# Altium project BopIt.PrjPcb
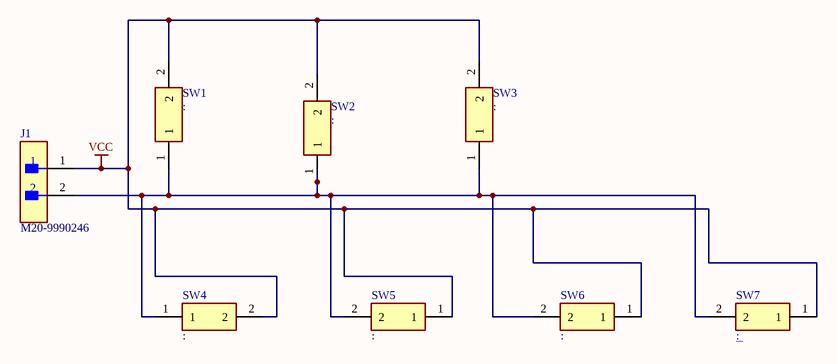
[diagram p0: CodeSchematic.SchDoc]
2 sheets, 43 parts. Net scope: global (net labels, ports and power ports of the same name join across sheets).
Board files: codePCB.PcbDoc, BopIt.PcbDoc
Sheets:
  CodeSchematic.SchDoc
  BopIt.SchDoc

## Sheet CodeSchematic.SchDoc
size A; SheetNumber: 2; SheetTotal: 2

### Parts
(Parts that share a designator on the sheet are numbered #1, #2 ... from top to bottom, then left to right.)
J1#1  M20-9990246  [FP-M20-9990246-MFG]
SW1#1  (no value)  [SW_PG151101S11]
SW2  (no value)  [SW_PG151101S11]
SW3  (no value)  [SW_PG151101S11]
SW4  (no value)  [SW_PG151101S11]
SW5  (no value)  [SW_PG151101S11]
SW6  (no value)  [SW_PG151101S11]
SW7  (no value)  [SW_PG151101S11]

### Nets
VCC: J1#1.1 SW1#1.2 SW2.2 SW3.2 SW4.2 SW5.1 SW6.1 SW7.1
NetJ1#1_2: J1#1.2 SW1#1.1 SW2.1 SW3.1 SW4.1 SW5.2 SW6.2 SW7.2

### Library data of the parts
J1#1 = CMP-15831-000009-1: CONN HEADER VERT 2POS 2.54MM; Manufacturer: Harwin; Conn Gender: Male; Conn Orientation: Vertical; Number Of Contacts: 2; Current Rating: 3A; ComponentLink2URL: https://cdn.harwin.com/pdfs/M20-999.pdf; ComponentLink2Description: Datasheet; Package: M20-9990246; Temperature: -40°C to +105°C; Octopart: https://octopart.com/m20-9990246-harwin-2590635; Mouser Description: 2.54mm (0.1") Pitch SIL Vertical PC Tail Pin Header, 6.1mm mating pin height, tin, 2 contacts; Temperature Range High: +105°C; Device Class L1: Connectors; RoHS: TRUE; Automotive: No; Height: 8.99mm; Number Of Rows: 1; Contact Material: Tin,Nickel; Category: Conn; Pitch: 2.54mm; Lead Free: Yes; Digikey Description: CONN HEADER VERT 2POS 2.54MM; Manufacturer Part Number: M20-9990246; Temperature Range Low: -40°C; Device Class L3: unset; Device Class L2: Headers and Wire Housings
SW1#1 SW2-SW7 = PG151101S11: Keyswitch; MF: Kailh; SnapEDA_Link: https://www.snapeda.com/parts/PG151101S11/Kailh/view-part/4218555/?ref=snap; Price: None; MP: PG151101S11; Availability: Unavailable; Value: *; Package: Package

## Sheet BopIt.SchDoc
size A; SheetNumber: 1; SheetTotal: 1
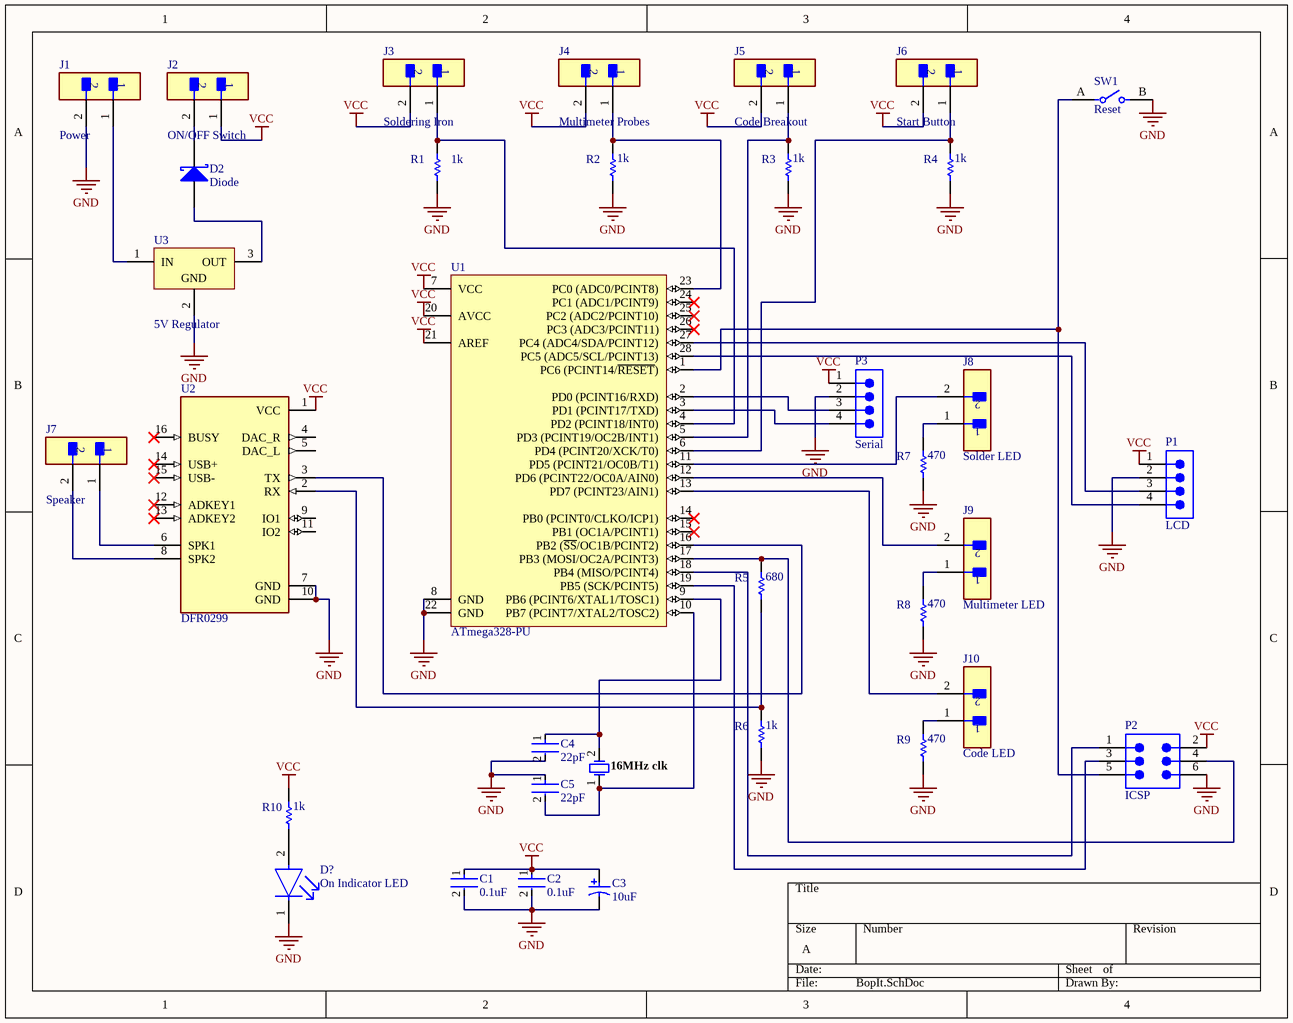
[diagram p1: BopIt.SchDoc]

### Parts
(Parts that share a designator on the sheet are numbered #1, #2 ... from top to bottom, then left to right.)
16MHz_clk  (no value)  [FOX-FOXSLF160-20]
C1  0.1uF  [FP-RDE0M1-MFG]
C2  0.1uF  [FP-RDE0M1-MFG]
C3  10uF  [CAPPR65-350-1150X800X1250]
C4  22pF  [FP-RDE0M1-MFG]
C5  22pF  [FP-RDE0M1-MFG]
D2  Diode  [STM-DO-35-2]
D?  On Indicator LED  [FP-SFH_4550-MFG]
J1#2  Power  [FP-M20-9990246-MFG]
J2  ON/OFF Switch  [FP-M20-9990246-MFG]
J3  Soldering Iron  [FP-M20-9990246-MFG]
J4  Multimeter Probes  [FP-M20-9990246-MFG]
J5  Code Breakout  [FP-M20-9990246-MFG]
J6  Start Button  [FP-M20-9990246-MFG]
J7  Speaker  [FP-M20-9990246-MFG]
J8  Solder LED  [FP-M20-9990246-MFG]
J9  Multimeter LED  [FP-M20-9990246-MFG]
J10  Code LED  [FP-M20-9990246-MFG]
P1  LCD  [61300411121]
P2  ICSP  [61300621121]
P3  Serial  [61300411121]
R1  1k  [RESA60-630X240]
R2  1k  [RESA60-630X240]
R3  1k  [RESA60-630X240]
R4  1k  [RESA60-630X240]
R5  680  [RESA60-630X240]
R6  1k  [RESA60-630X240]
R7  470  [RESA60-630X240]
R8  470  [RESA60-630X240]
R9  470  [RESA60-630X240]
R10  1k  [RESA60-630X240]
SW1#2  Reset  [FP-EVQ-11L07K-MFG]
U1  ATmega328-PU  [28P3]
U2  DFR0299  [MODULE_DFR0299]
U3  5V Regulator  [TO220]

### Nets
GND: C1.2 C2.2 C3.2 C4.2 C5.1 D?.1(C) J1#2.2 P1.2 P2.6 P3.2 R1.1 R2.1 R3.2 R4.2 R6.2 R7.1 R8.1 R9.1 SW1#2.B U1.8(GND) U1.22(GND) U2.7(GND) U2.10(GND) U3.2(GND)
VCC: C1.1 C2.1 C3.1 J2.1 J3.2 J4.2 J5.2 J6.2 P1.1 P2.2 P3.1 R10.1 U1.7(VCC) U1.20(AVCC) U1.21(AREF) U2.1(VCC)
Net16MHz_clk_1: 16MHz_clk.1 C5.2 U1.10(PB7_(PCINT7/XTAL2/TOSC2))
Net16MHz_clk_2: 16MHz_clk.2 C4.1 U1.9(PB6_(PCINT6/XTAL1/TOSC1))
NetD2_1: D2.1(A) U3.3(OUT)
NetD2_2: D2.2(K) J2.2
NetD?_2: D?.2(A) R10.2
NetJ1#2_1: J1#2.1 U3.1(IN)
NetJ3_1: J3.1 R1.2 U1.4(PD2_(PCINT18/INT0))
NetJ4_1: J4.1 R2.2 U1.23(PC0_(ADC0/PCINT8))
NetJ5_1: J5.1 R3.1 U1.5(PD3_(PCINT19/OC2B/INT1))
NetJ6_1: J6.1 R4.1 U1.6(PD4_(PCINT20/XCK/T0))
NetJ7_1: J7.1 U2.6(SPK1)
NetJ7_2: J7.2 U2.8(SPK2)
NetJ8_1: J8.1 R7.2
NetJ8_2: J8.2 U1.11(PD5_(PCINT21/OC0B/T1))
NetJ9_1: J9.1 R8.2
NetJ9_2: J9.2 U1.12(PD6_(PCINT22/OC0A/AIN0))
NetJ10_1: J10.1 R9.2
NetJ10_2: J10.2 U1.13(PD7_(PCINT23/AIN1))
NetP1_3: P1.3 U1.27(PC4_(ADC4/SDA/PCINT12))
NetP1_4: P1.4 U1.28(PC5_(ADC5/SCL/PCINT13))
NetP2_1: P2.1 U1.18(PB4_(MISO/PCINT4))
NetP2_3: P2.3 U1.19(PB5_(SCK/PCINT5))
NetP2_4: P2.4 R5.1 U1.17(PB3_(MOSI/OC2A/PCINT3))
NetP2_5: P2.5 SW1#2.A U1.1(PC6_(PCINT14/~{RESET}))
NetP3_3: P3.3 U1.2(PD0_(PCINT16/RXD))
NetP3_4: P3.4 U1.3(PD1_(PCINT17/TXD))
NetR5_2: R5.2 R6.1 U2.2(RX)
NetU1_16: U1.16(PB2_(~{SS}/OC1B/PCINT2)) U2.3(TX)

Not connected (* = marked no-connect by the designer): U1 14(PB0_(PCINT0/CLKO/ICP1))* 15(PB1_(OC1A/PCINT1))* 24(PC1_(ADC1/PCINT9))* 25(PC2_(ADC2/PCINT10))* 26(PC3_(ADC3/PCINT11))*; U2 4(DAC_R) 5(DAC_L) 9(IO1) 11(IO2) 12(ADKEY1)* 13(ADKEY2)* 14(USB+)* 15(USB-)* 16(BUSY)*

### Library data of the parts
16MHz_clk = CMP-1749-00003-1: Resistance Weld Thru-Hole Crystal, 16 MHz, -20 to 70 degC, 2-Pin THD, RoHS, Bulk; Voltage Rating: 250 V; Tolerance: 1%; Resistance: 221 kohm; Case\Package: Axial; Power Rating: 250 mW; RoHSCompliant: true; Package Quantity: 200; Packaging: Bulk; Min Operating Temperature: -55 degC; DatasheetVersion: Mar-15; ComponentLink1URL: http://www.foxonline.com/; Max Operating Temperature: 155 degC; PackageReference: FOXSLF160-20; Mount: Through Hole; PackageDescription: 2-Pin Through Hole Device, Body 11.35 x 4.65 mm; ComponentLink1Description: Manufacturer URL; ComponentLink2URL: http://www.foxonline.com/pdfs/hc49slf.pdf; ComponentLink2Description: Datasheet; Length: 0.248 inch
C1 C2 C4 C5 = CMP-06035-043024-1: Ceramic Capacitor 10nF ±10% 50V X7R Radial; Lead/Base Style: Kinked; Lead Diameter: 0.5mm; Width: 0.098inch; Tolerance: 10%; Package Quantity: 500; Termination: Radial; Resistor Type: Ceramic; Min Operating Temperature: -55°C; Packaging: Bulk; Height - Seated (Max): 0.236inch; Height: 3.5mm; Lead Pitch: 0.197inch; Capacitance: 10nF; Length: 0.157inch; Lead Free: Lead Free; Max Operating Temperature: 125°C; Mount: Through Hole; Voltage Rating (DC): 50V; Voltage Rating: 50V; Case/Package: Radial; Dielectric: X7R
C3 = CMP-1665-00041-1: Aluminum Electrolytic Capacitor, 47 uF, +/- 20%, 100 V, -40 to 85 degC, 2-Pin THD, RoHS, Bulk; Data Rate: 54 mbps; Nominal Supply Voltage: 3.3 V; Case\Package: QFN; ComponentLink1URL: http://www.panasonic.com/; Packaging: Tape and Reel; PackageDescription: 2-Pin Radial Lead, Dia 8 mm, Body Length 11.5 mm; PackageReference: CAPPR65-350-1150X800X1250; ComponentLink2Description: Datasheet; Max Operating Temperature: 70 degC; ComponentLink2URL: http://industrial.panasonic.com/cdbs/www-data/pdf/RDF0000/ABA0000C1047.pdf; RoHSCompliant: true; Length: 7.7 mm; Min Operating Temperature: -20 degC; DatasheetVersion: Mar-16; Mount: Surface Mount; Pins: 48; Radiation Hardening: No; Package Quantity: 500; ComponentLink1Description: Manufacturer URL
D2 = CMP-2000-05926-1: Small Signal Schottky Diode, 150 mA, 100 V, -65 to 125 degC, 2-Pin DO-35, RoHS, Tape and Reel; Manufacturer: STMicroelectronics; SVHC: NoSVHC(15-Jun-2015); Diode Configuration: Single; No. of Pins: 2Pins; Forward Surge Current Ifsm Max: 750mA; Repetitive Reverse Voltage Vrrm Max: 100V; Diode Case Style: DO-204AH; Forward Voltage VF Max: 1V; Forward Current If(AV): 150mA; Manufacturer URL: http://www.st.com/; Packaging: Tape&Reel; Package Reference: DO-35-2; Datasheet URL: http://www.st.com/content/ccc/resource/technical/document/datasheet/group1/11/76/e4/a3/df/07/49/14/CD00000767/files/CD00000767.pdf/jcr:content/translations/en.CD00000767.pdf; Diode Type: Schottky; Mounting Technology: ThroughHole; Package Description: 2-Pin Axial Lead, Dia 1.765 mm, Body Length 3.775 mm; Product Range: -; Datasheet Version: Rev. 2.1, 10/2001; Operating Temperature Max: 125°C
D? = CMP-62016-000011-1: EMITTER IR 860NM 100MA RADIAL; Manufacturer: Osram Opto; Forward Voltage: 1.5V; Reverse Voltage: 5V; Viewing Angle: 6°; Led Orientation: Straight; Colour: Infrared; Mouser Description: Infrared Emitters - High Power Infrared 850 nm HALF ANGLE +/-3DEG; RoHS: TRUE; Manufacturer Part Number: SFH 4550; Forward Current: 100mA; Octopart: https://octopart.com/sfh+4550-osram+opto-55410894; ComponentLink2Description: Datasheet; Lead Free: Yes; Temperature: -40°C to +100°C; ComponentLink2URL: https://dammedia.osram.info/media/resource/hires/osram-dam-5580407/SFH%204550_EN.pdf; Device Class L2: LEDs; Temperature Range Low: -40°C; Digikey Description: EMITTER IR 860NM 100MA RADIAL; Temperature Range High: +100°C; Device Class L3: unset; Peak Emmision Wavelength: 860nm; Category: Diode; Package: SFH 4550; Device Class L1: Optoelectronics; Automotive: No
J1#2 J2-J10 = CMP-15831-000009-1: CONN HEADER VERT 2POS 2.54MM; Manufacturer: Harwin; Manufacturer Part Number: M20-9990246; Conn Gender: Male; Conn Orientation: Vertical; Number Of Contacts: 2; Current Rating: 3A; ComponentLink2URL: https://cdn.harwin.com/pdfs/M20-999.pdf; ComponentLink2Description: Datasheet; Package: M20-9990246; Temperature: -40°C to +105°C; Octopart: https://octopart.com/m20-9990246-harwin-2590635; Mouser Description: 2.54mm (0.1") Pitch SIL Vertical PC Tail Pin Header, 6.1mm mating pin height, tin, 2 contacts; Temperature Range High: +105°C; Device Class L1: Connectors; RoHS: TRUE; Automotive: No; Height: 8.99mm; Number Of Rows: 1; Contact Material: Tin,Nickel; Category: Conn; Pitch: 2.54mm; Lead Free: Yes; Digikey Description: CONN HEADER VERT 2POS 2.54MM; Temperature Range Low: -40°C; Device Class L3: unset; Device Class L2: Headers and Wire Housings
P1 P3 = CMP-1502-01064-3: NexarPartId: 32855522; Operating Supply Voltage: 250V; Pitch: 2.54mm; Contact Resistance: 20mΩ; Number of Positions: 4; Current Rating: 3A; Connector Type: Male Pin; Gender: Male; Contact Plating: Gold; Height: 8.89mm; Lead Pitch: 2.54mm; Lead Free: Lead Free; Contact Mating Length: 5.9944mm; Number of Rows: 1; Termination: Solder; Packaging: Bulk; REACH SVHC: Unknown; Min Operating Temperature: -40°C; RoHS: Compliant; Number of Contacts: 4; Voltage Rating: 250V; Color: Black; Max Operating Temperature: 105°C; Contact Material: Copper; Mount: Through Hole; Orientation: Vertical; Number of Pins: 4
P2 = CMP-1502-01072-3: NexarPartId: 32855529; Row Spacing: 2.54mm; Current Rating: 3A; Voltage Rating: 250V; Contact Resistance: 20mΩ; Connector Type: Male Pin; Number of Positions: 6; Gender: Male; Termination: Solder; Orientation: Vertical; Max Operating Temperature: 105°C; Contact Plating: Gold; Height: 8.89mm; Contact Mating Length: 5.9944mm; Mount: Through Hole; Min Operating Temperature: -40°C; Lead Pitch: 2.54mm; Number of Pins: 6; Operating Supply Voltage: 250V; Color: Black; Pitch: 2.54mm; Packaging: Bulk; Contact Material: Copper; REACH SVHC: Unknown; RoHS: Compliant; Number of Rows: 2; Number of Contacts: 6
R1-R10 = CMP-1659-00067-1: Axial Resistor, 47.5 Ohm, +/- 1%, 0.25 W, -55 to 155 degC, 2-Pin THD, RoHS, Bulk; Nominal Voltage Gain: 100 dB; Slew Rate: 1 V\us; Common Mode Rejection Ratio: 50 dB; Bandwidth: 1 MHz; Min Supply Voltage: 3 V; Case\Package: SOIC; Output Current: 160 mA; Channels: 4; Max Supply Voltage: 5 V; Nominal Supply Current: 170 uA; Packaging: Tape and Reel; Pins: 14; ComponentLink1URL: http://www.yageo.com/; RoHSCompliant: true; Radiation Hardening: No; Width: 3.91 mm; ComponentLink2Description: Datasheet; PackageReference: MFR-25; Length: 8.65 mm; ComponentLink1Description: Manufacturer URL; Mount: Surface Mount; Nominal Gain Bandwith Product: 1 MHz; DatasheetVersion: Apr-13; Unity Gain Bandwidth Product: 1 MHz; Min Operating Temperature: -40 degC; Max Operating Temperature: 85 degC; PackageDescription: 2-Pin Axial Lead, Dia 2.4 mm, Body Length 6.3 mm; ComponentLink2URL: http://www.yageo.com/documents/recent/Yageo%20LR_MFR_2013.pdf; Package Quantity: 2500; Height: 1.58 mm; REACH SVHC: No SVHC
SW1#2 = CMP-00287-55397191-1: EVQ-11L07K Switch Tactile N.O. SPST Round Button PC Pins 0.02A 15VDC 1.6N Thru-Hole Radial T/R; Electrical Life: 100kcycles; Illumination Type: Illuminated, Non-Illuminated; Voltage Rating (DC): 15V; Switch Travel: 250µm; Number of Positions: 2; Current Rating: 20mA; Actuator Length: 3.1mm; Contact Resistance: 50mΩ; Switch Function: Off-Mom; Width: 6mm; Life (Cycles): 100kcycles; Mechanical Life: 100kcycles; Length: 6mm; Min Operating Temperature: -20°C; Orientation: Straight; Operating Force: 1.6N; RoHS: Compliant; Mount: Through Hole; REACH SVHC: Unknown; Number of Pins: 2; Height: 3.9mm; Case/Package: Radial; Max Operating Temperature: 70°C; Contact Current Rating: 20mA; NexarPartId: 55397191; Max Voltage Rating (DC): 15V; Throw Configuration: SPST; Radiation Hardening: No; Termination: PC Pin; Lead Free: Lead Free
U1 = CMP-0095-00015-2: 8-bit AVR Microcontroller, 32KB Flash, 1KB EEPROM, 2KB SRAM, 28-pin PDIP, Industrial Grade (-40°C to 85°C); ComponentLink3Description: ATmega48A/48PA/88A/88PA/168A/168PA/328/328P Summary; RevisionNote: DatasheetVersion updated. URLs added.; DatasheetVersion: revD, May-2011; ComponentLink1URL: http://www.atmel.com/; PackageVersion: revB, Sep-2001; PackageDescription: 28-lead (0.300"/7.62mm Wide) Plastic Dual Inline Package (PDIP); PackageReference: 28P3; ComponentLink1Description: Manufacturer URL; ComponentLink2Description: ATmega48A/48PA/88A/88PA/168A/168PA/328/328P Datasheet; ComponentLink3URL: http://www.atmel.com/dyn/resources/prod_documents/8271S.pdf; ComponentLink2URL: http://www.atmel.com/dyn/resources/prod_documents/8271.pdf
U2 = CMP-153-000000-1: Dfplayer - a Mini Mp3 Player; Value: *; Source: DFR0299.SchLib; Package: None; Pin Count: 16; Price: None; Component Type: Standard; MP: DFR0299; Availability: Unavailable; Design Item ID: DFR0299
U3 = CMP-0244-00484-1: Positive Voltage Regulator, 5V, 3-Pin TO-220; DatasheetVersion: 16/11/2011; ComponentLink2Description: Datasheet; ComponentLink3Description: Package Specification; ComponentLink2URL: http://www.st.com/internet/com/TECHNICAL_RESOURCES/TECHNICAL_LITERATURE/DATASHEET/CD00000444.pdf; PackageDescription: TO, Thru-Hole, Vertical, Heatsink Mounted; 3 In-Line Leads; Pitch 2.54 mm; ComponentLink3URL: http://www.st.com/internet/com/TECHNICAL_RESOURCES/TECHNICAL_LITERATURE/PACKAGE_INFORMATION/CD00004649.pdf; PackageReference: TO220; ComponentLink1URL: http://www.st.com; PackageVersion: ver3.0; ComponentLink1Description: Manufacturer URL

## Nets that join several sheets
VCC: CodeSchematic (8 pins), BopIt (16 pins)